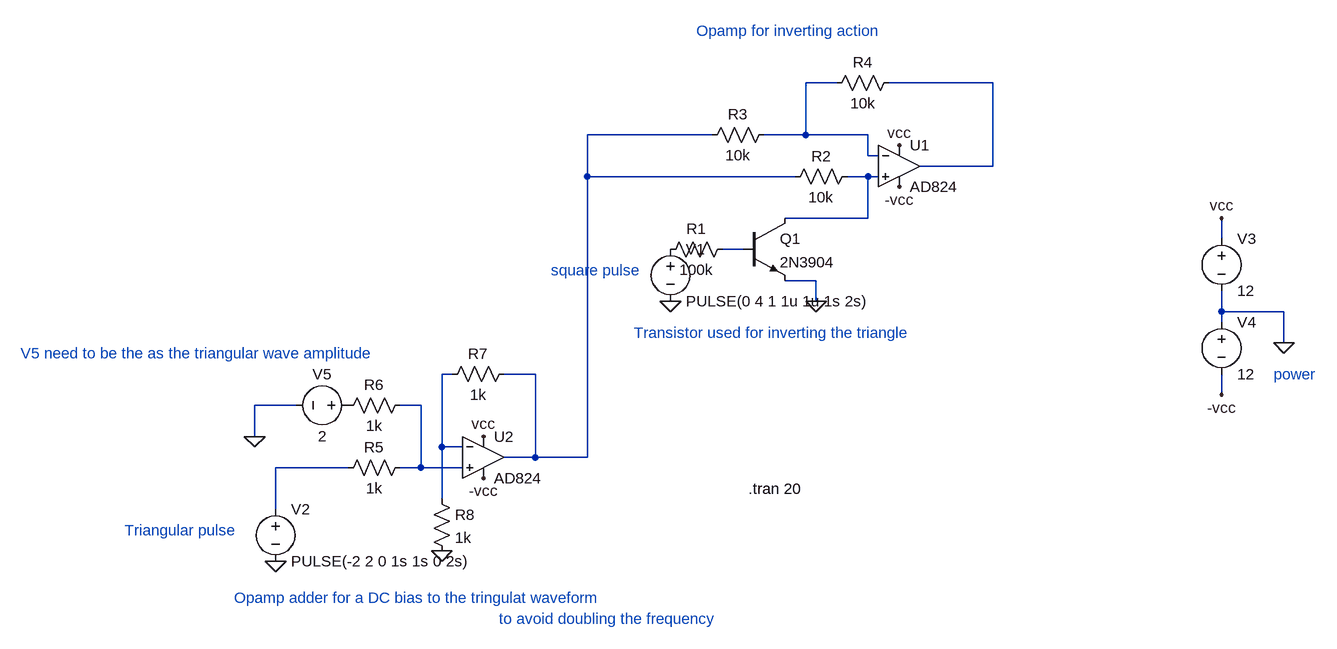
[diagram p0: schematic Saw Tooth Modified.asc]
Saw Tooth Modified.asc, the LTspice schematic file:
Version 4
SHEET 1 1260 680
WIRE 512 -176 464 -176
WIRE 752 -176 592 -176
WIRE 320 -96 128 -96
WIRE 464 -96 464 -176
WIRE 464 -96 400 -96
WIRE 560 -96 464 -96
WIRE 560 -64 560 -96
WIRE 576 -64 560 -64
WIRE 752 -48 752 -176
WIRE 752 -48 640 -48
WIRE 128 -32 128 -96
WIRE 448 -32 128 -32
WIRE 560 -32 528 -32
WIRE 576 -32 560 -32
WIRE 560 32 560 -32
WIRE 560 32 432 32
WIRE 1104 64 1104 32
WIRE 368 80 336 80
WIRE 480 128 432 128
WIRE 480 160 480 128
WIRE 1104 176 1104 144
WIRE 1200 176 1104 176
WIRE 1104 192 1104 176
WIRE 1200 224 1200 176
WIRE -80 272 -96 272
WIRE 48 272 0 272
WIRE 1104 304 1104 272
WIRE -320 320 -384 320
WIRE -128 320 -160 320
WIRE -384 368 -384 320
WIRE -96 384 -96 272
WIRE -64 384 -96 384
WIRE 48 400 48 272
WIRE 48 400 0 400
WIRE 128 400 128 -32
WIRE 128 400 48 400
WIRE -240 416 -352 416
WIRE -128 416 -128 320
WIRE -128 416 -160 416
WIRE -64 416 -128 416
WIRE -96 464 -96 384
WIRE -352 480 -352 416
FLAG 480 160 0
FLAG 256 160 0
FLAG -352 560 0
FLAG 1104 32 vcc
FLAG 1104 304 -vcc
FLAG 1200 224 0
FLAG 608 -80 vcc
FLAG 608 -16 -vcc
FLAG -32 432 -vcc
FLAG -32 368 vcc
FLAG -384 368 0
FLAG -96 544 0
SYMBOL voltage 256 64 R0
WINDOW 123 0 0 Left 0
WINDOW 39 0 0 Left 0
SYMATTR InstName V1
SYMATTR Value PULSE(0 4 1 1u 1u 1s 2s)
SYMBOL voltage -352 464 R0
WINDOW 123 0 0 Left 0
WINDOW 39 0 0 Left 0
SYMATTR InstName V2
SYMATTR Value PULSE(-2 2 0 1s 1s 0 2s)
SYMBOL npn 368 32 R0
SYMATTR InstName Q1
SYMATTR Value 2N3904
SYMBOL res 352 64 R90
WINDOW 0 0 56 VBottom 2
WINDOW 3 32 56 VTop 2
SYMATTR InstName R1
SYMATTR Value 100k
SYMBOL OpAmps\\AD824 608 -112 R0
SYMATTR InstName U1
SYMBOL res 544 -48 R90
WINDOW 0 0 56 VBottom 2
WINDOW 3 32 56 VTop 2
SYMATTR InstName R2
SYMATTR Value 10k
SYMBOL res 416 -112 R90
WINDOW 0 0 56 VBottom 2
WINDOW 3 32 56 VTop 2
SYMATTR InstName R3
SYMATTR Value 10k
SYMBOL res 608 -192 R90
WINDOW 0 0 56 VBottom 2
WINDOW 3 32 56 VTop 2
SYMATTR InstName R4
SYMATTR Value 10k
SYMBOL voltage 1104 48 R0
WINDOW 123 0 0 Left 0
WINDOW 39 0 0 Left 0
SYMATTR InstName V3
SYMATTR Value 12
SYMBOL voltage 1104 176 R0
WINDOW 123 0 0 Left 0
WINDOW 39 0 0 Left 0
SYMATTR InstName V4
SYMATTR Value 12
SYMBOL OpAmps\\AD824 -32 336 R0
SYMATTR InstName U2
SYMBOL res -144 400 R90
WINDOW 0 0 56 VBottom 2
WINDOW 3 32 56 VTop 2
SYMATTR InstName R5
SYMATTR Value 1k
SYMBOL res -144 304 R90
WINDOW 0 0 56 VBottom 2
WINDOW 3 32 56 VTop 2
SYMATTR InstName R6
SYMATTR Value 1k
SYMBOL voltage -224 320 R90
WINDOW 0 -32 56 VBottom 2
WINDOW 3 32 56 VTop 2
WINDOW 123 0 0 Left 0
WINDOW 39 0 0 Left 0
SYMATTR InstName V5
SYMATTR Value 2
SYMBOL res 16 256 R90
WINDOW 0 0 56 VBottom 2
WINDOW 3 32 56 VTop 2
SYMATTR InstName R7
SYMATTR Value 1k
SYMBOL res -112 448 R0
SYMATTR InstName R8
SYMATTR Value 1k
TEXT 376 448 Left 2 !.tran 20
TEXT 1184 272 Left 2 ;power
TEXT 200 208 Left 2 ;Transistor used for inverting the triangle
TEXT 296 -256 Left 2 ;Opamp for inverting action
TEXT -416 616 Left 2 ;Opamp adder for a DC bias to the tringulat waveform
TEXT -8 648 Left 2 ;to avoid doubling the frequency
TEXT -744 240 Left 2 ;V5 need to be the as the triangular wave amplitude
TEXT -584 512 Left 2 ;Triangular pulse
TEXT 72 112 Left 2 ;square pulse

The netlist it stands for:
* Saw Tooth Modified.asc
V1 P001 0 PULSE(0 4 1 1u 1u 1s 2s)
V2 N008 0 PULSE(-2 2 0 1s 1s 0 2s)
Q1 N004 N005 0 0 2N3904
R1 N005 P001 100k
XU1 N004 N001 vcc -vcc N002 AD824  ; pins In+ In- V+ V- OUT
R2 N004 N003 10k
R3 N001 N003 10k
R4 N002 N001 10k
V3 vcc 0 12
V4 0 -vcc 12
XU2 N007 N006 vcc -vcc N003 AD824  ; pins In+ In- V+ V- OUT
R5 N007 N008 1k
R6 N007 P002 1k
V5 P002 0 2
R7 N003 N006 1k
R8 N006 0 1k
.model NPN NPN
.model PNP PNP
.lib standard.bjt
.tran 20
* power
* Transistor used for inverting the triangle
* Opamp for inverting action
* Opamp adder for a DC bias to the tringulat waveform
* to avoid doubling the frequency
* V5 need to be the as the triangular wave amplitude
* Triangular pulse
* square pulse
.backanno
.end